# EAGLE design HARE - Master Schematic v1.0 (EAGLE 8.4.1)
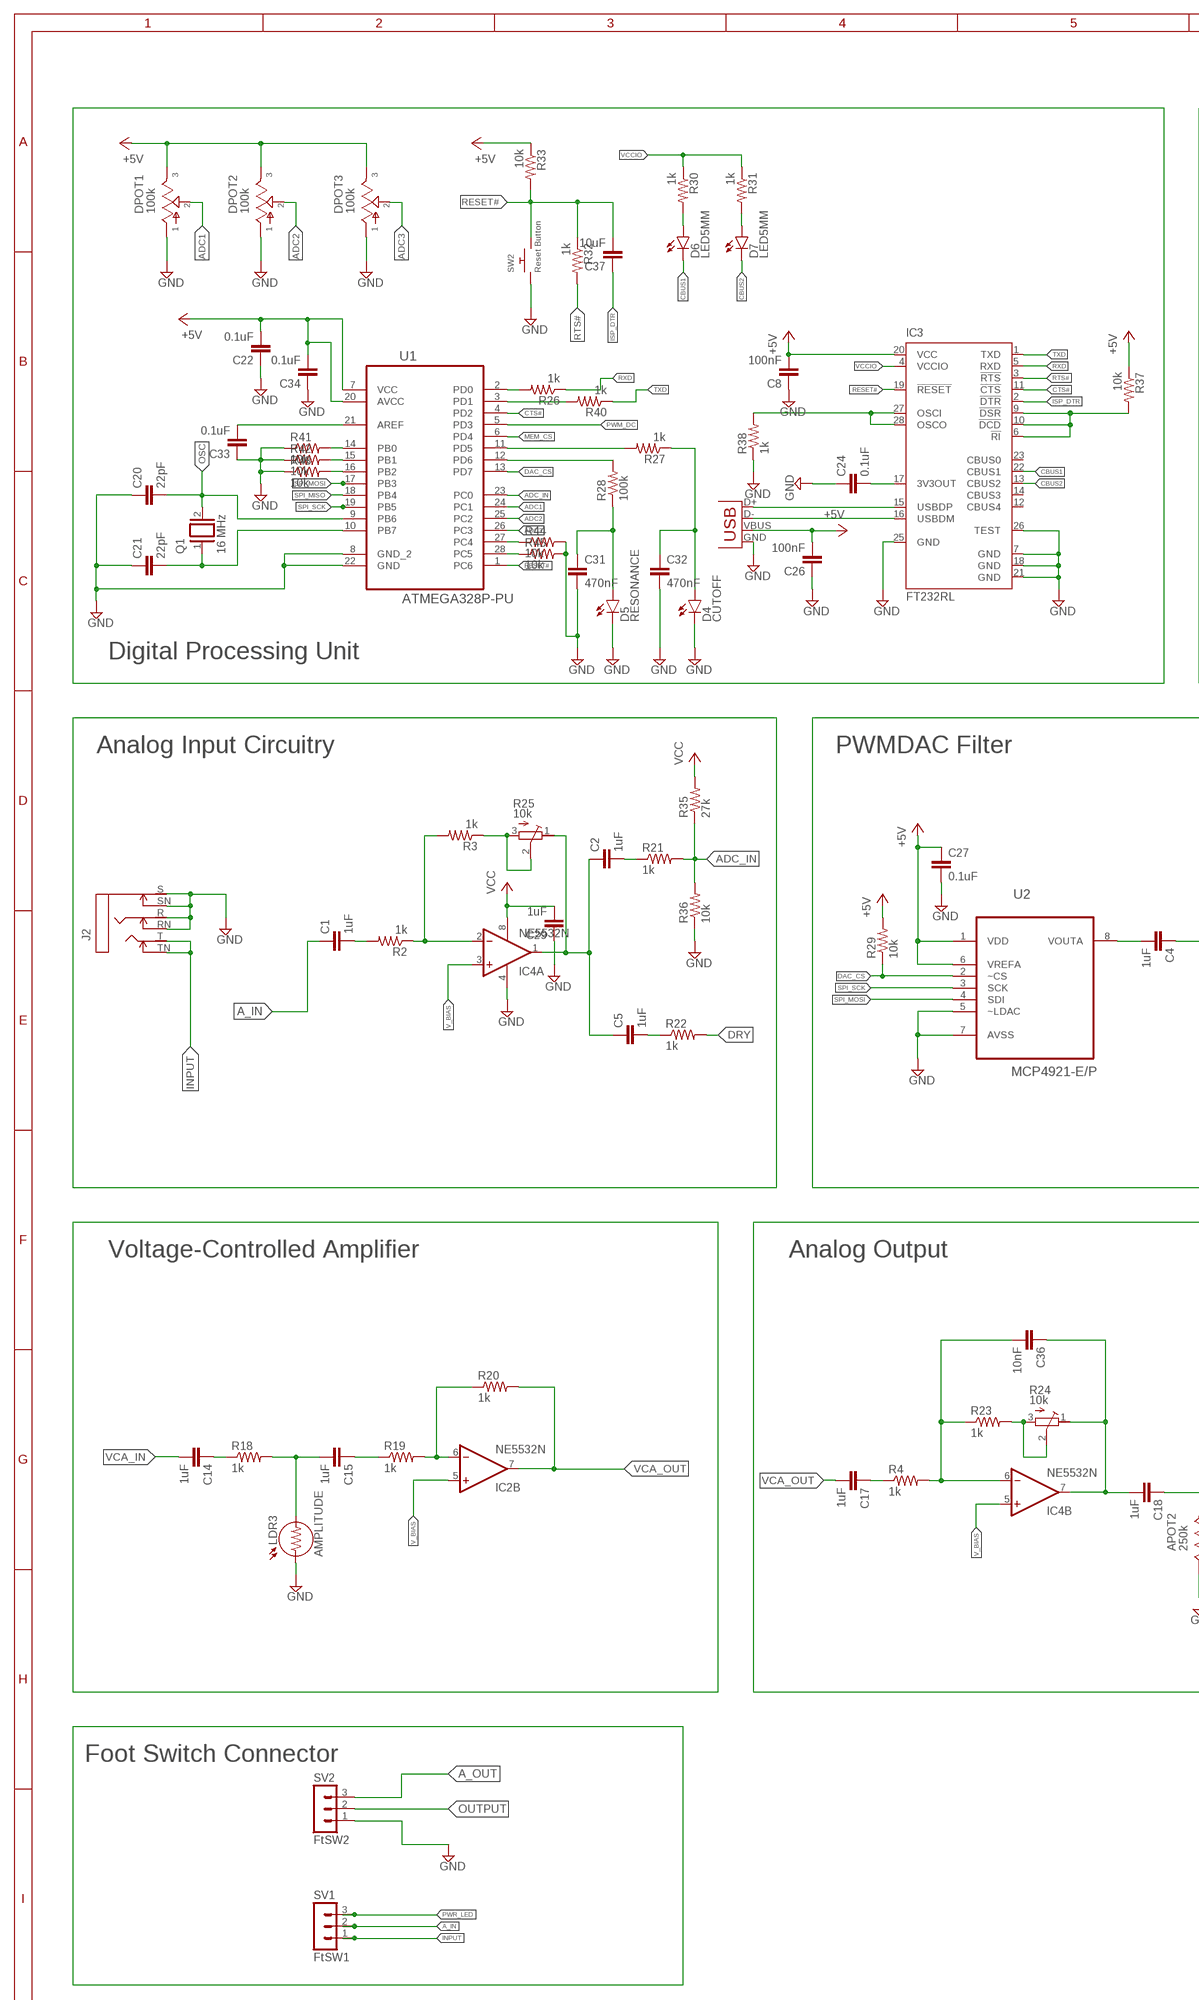
[diagram p0: schematic, sheet 1, part 1 of 2]
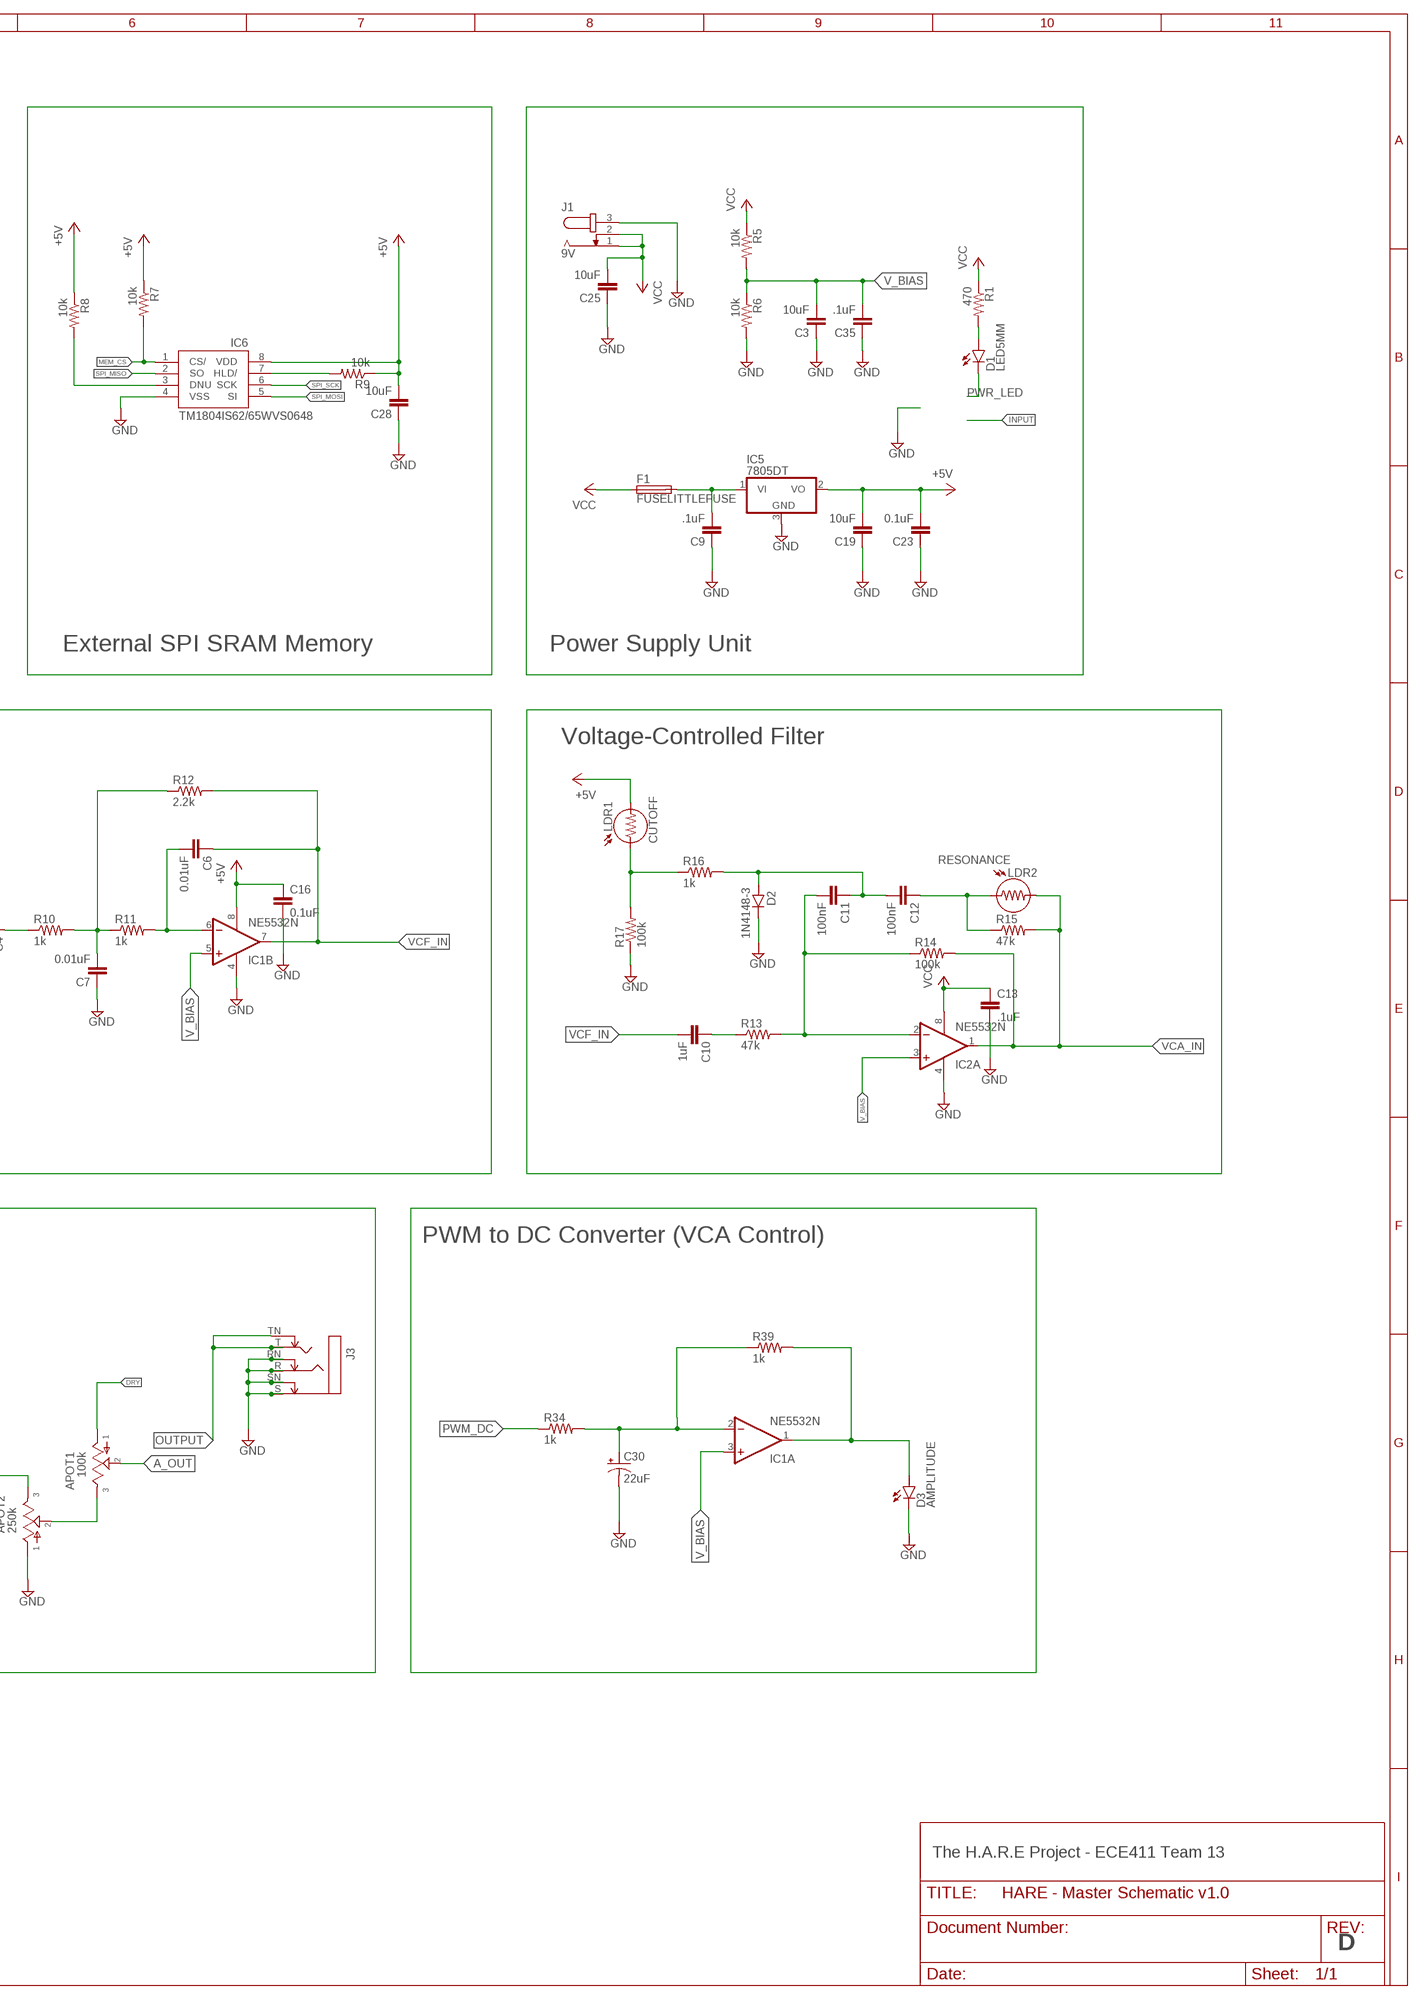
[diagram p1: schematic, sheet 1, part 2 of 2]

## Parts
APOT1  100k  POTS  [16MM-SQUARE]
APOT2  250k  POTS  [16MM-SQUARE]
C1  1uF  C-EUC0805K  [C0805K]
C2  1uF  C-EUC0805K  [C0805K]
C3  10uF  C-EUC0805K  [C0805K]
C4  1uF  C-EUC0805K  [C0805K]
C5  1uF  C-EUC0805K  [C0805K]
C6  0.01uF  C-EUC0805K  [C0805K]
C7  0.01uF  C-EUC0805K  [C0805K]
C8  100nF  C-EUC0805K  [C0805K]
C9  .1uF  C-EUC0805K  [C0805K]
C10  1uF  C-EUC0805K  [C0805K]
C11  100nF  C-EUC0805K  [C0805K]
C12  100nF  C-EUC0805K  [C0805K]
C13  .1uF  C-EUC0805K  [C0805K]
C14  1uF  C-EUC0805K  [C0805K]
C15  1uF  C-EUC0805K  [C0805K]
C16  0.1uF  C-EUC0805K  [C0805K]
C17  1uF  C-EUC0805K  [C0805K]
C18  1uF  C-EUC0805K  [C0805K]
C19  10uF  C-EUC0805K  [C0805K]
C20  22pF  C-EUC0805K  [C0805K]
C21  22pF  C-EUC0805K  [C0805K]
C22  0.1uF  C-EUC0805K  [C0805K]
C23  0.1uF  C-EUC0805K  [C0805K]
C24  0.1uF  C-EUC0805K  [C0805K]
C25  10uF  C-EUC0805K  [C0805K]
C26  100nF  C-EUC0805K  [C0805K]
C27  0.1uF  C-EUC0805K  [C0805K]
C28  10uF  C-EUC0805K  [C0805K]
C29  1uF  C-EUC0805K  [C0805K]
C30  22uF  0501  [050_020_1]
C31  470nF  072X0352  [072X035]
C32  470nF  072X0352  [072X035]
C33  0.1uF  C-EUC0805K  [C0805K]
C34  0.1uF  C-EUC0805K  [C0805K]
C35  .1uF  C-EUC0805K  [C0805K]
C36  10nF  C-EUC0805K  [C0805K]
C37  10uF  C-EUC0805K  [C0805K]
D1  LED5MM  [LED5MM]
D2  1N4148-3  [DO35-3]
D3  AMPLITUDE  LED5MM  [LED5MM]
D4  CUTOFF  LED5MM  [LED5MM]
D5  RESONANCE  LED5MM  [LED5MM]
D6  LED5MM  [LED5MM]
D7  LED5MM  [LED5MM]
DPOT1  100k  POTS  [16MM-SQUARE]
DPOT2  100k  POTS  [16MM-SQUARE]
DPOT3  100k  POTS  [16MM-SQUARE]
F1  FUSELITTLEFUSE  [LITTLEFUSE]
IC1  NE5532N  [DIL08]
IC2  NE5532N  [DIL08]
IC3  FT232RL  [SSOP28]
IC4  NE5532N  [DIL08]
IC5  7805DT  [TO252]
IC6  TM1804IS62/65WVS0648  [SO08]
J1  9V  JACK-PLUG1  [SPC4078]
J2  STEREOSW  [NMJ6HCD2]
J3  STEREOSW  [NMJ6HCD2]
LDR1  CUTOFF  LDR5MM  [LDR338-54C]
LDR2  RESONANCE  LDR5MM  [LDR338-54C]
LDR3  AMPLITUDE  LDR5MM  [LDR338-54C]
Q1  16 MHz  XTAL/S  [QS]
R1  470  R-US_M0805  [M0805]
R2  1k  R-US_R0805  [R0805]
R3  1k  R-US_R0805  [R0805]
R4  1k  R-US_R0805  [R0805]
R5  10k  R-US_M0805  [M0805]
R6  10k  R-US_M0805  [M0805]
R7  10k  R-US_M0805  [M0805]
R8  10k  R-US_M0805  [M0805]
R9  10k  R-US_M0805  [M0805]
R10  1k  R-US_R0805  [R0805]
R11  1k  R-US_R0805  [R0805]
R12  2.2k  R-US_R0805  [R0805]
R13  47k  R-US_R0805  [R0805]
R14  100k  R-US_R0805  [R0805]
R15  47k  R-US_R0805  [R0805]
R16  1k  R-US_R0805  [R0805]
R17  100k  R-US_R0805  [R0805]
R18  1k  R-US_R0805  [R0805]
R19  1k  R-US_R0805  [R0805]
R20  1k  R-US_R0805  [R0805]
R21  1k  R-US_R0805  [R0805]
R22  1k  R-US_R0805  [R0805]
R23  1k  R-US_R0805  [R0805]
R24  10k  R-TRIMM3314G  [RTRIM3314G]
R25  10k  R-TRIMM3314G  [RTRIM3314G]
R26  1k  R-US_R0805  [R0805]
R27  1k  R-US_R0805  [R0805]
R28  100k  R-US_R0805  [R0805]
R29  10k  R-US_R0805  [R0805]
R30  1k  R-US_R0805  [R0805]
R31  1k  R-US_R0805  [R0805]
R32  1k  R-US_R0805  [R0805]
R33  10k  R-US_R0805  [R0805]
R34  1k  R-US_R0805  [R0805]
R35  27k  R-US_R0805  [R0805]
R36  10k  R-US_R0805  [R0805]
R37  10k  R-US_R0805  [R0805]
R38  1k  R-US_R0805  [R0805]
R39  1k  R-US_R0805  [R0805]
R40  1k  R-US_R0805  [R0805]
R41  10k  R-US_R0805  [R0805]
R42  10k  R-US_R0805  [R0805]
R43  10k  R-US_R0805  [R0805]
R44  10k  R-US_R0805  [R0805]
R45  10k  R-US_R0805  [R0805]
SV1  FtSW1  MA03-1  [MA03-1]
SV2  FtSW2  MA03-1  [MA03-1]
SW2  Reset Button  SWITCH_PUSHBUTTONSOFTTOUCHSMD_SJ  [PUSHBUTTON_SMD_SJ]
U1  ATMEGA328P-PU  [DIP254P762X457-28]
U2  MCP4921-E/P  [DIP254P762X432-8]
X2  USB-B-H  [USB-B-H]

## Nets
+5V: C8.2 C16.1 C19.2 C22.2 C23.2 C26.2 C27.1 C28.2 C34.2 DPOT1.3 DPOT2.3 DPOT3.3 IC1.8(P:V+) IC3.20(VCC) IC5.2(VO) IC6.8(VDD) LDR1.2 R7.1 R8.1 R9.1 R29.2 R33.1 R37.1 U1.7(VCC) U1.20(AVCC) U2.1(VDD) U2.6(VREFA) X2.VBUS
+5V1: C33.2 U1.21(AREF)
A_IN: C1.1 SV1.2
A_OUT: APOT1.2 SV2.3
ADC1: DPOT1.2 U1.24(PC1)
ADC2: DPOT2.2 U1.25(PC2)
ADC3: DPOT3.2 U1.26(PC3)
ADC_IN: R21.2 R35.1 R36.2 U1.23(PC0)
CBUS1: D6.K(C) IC3.22(CBUS1)
CBUS2: D7.K(C) IC3.13(CBUS2)
CTS#: IC3.11(!CTS) U1.4(PD2)
DAC_CS: R29.1 U1.13(PD7) U2.2(~CS)
DRY: APOT1.1 R22.2
GND: APOT2.1 C3.1 C7.1 C8.1 C9.1 C13.2 C16.2 C19.1 C20.1 C21.1 C22.1 C23.1 C24.1 C25.1 C26.1 C27.2 C28.1 C29.1 C30.- C31.2 C32.2 C33.1 C34.1 C35.1 D2.C D3.K(C) D4.K(C) D5.K(C) DPOT1.1 DPOT2.1 DPOT3.1 IC1.4(P:V-) IC2.4(P:V-) IC3.7(GND) IC3.18(GND) IC3.21(GND) IC3.25(GND) IC3.26(TEST) IC4.4(P:V-) IC5.3(GND) IC6.4(VSS) J1.3 J2.R J2.RN J2.S J2.SN J3.R J3.RN J3.S J3.SN LDR3.1 R6.2 R17.1 R36.1 R38.1 R41.1 R42.1 R43.1 R44.2 R45.2 SV2.1 SW2.P$1 U1.8(GND_2) U1.22(GND) U2.5(~LDAC) U2.7(AVSS) X2.GND
INPUT: J2.T J2.TN SV1.1
ISP_DTR: C37.1 IC3.2(!DTR)
MEM_CS: IC6.1(CS/) R7.2 U1.6(PD4)
N$7: D1.A R1.2
N$8: IC6.7(HLD/) R9.2
N$10: C1.2 R2.2
N$11: IC4.2(A:-IN) R2.1 R3.2
N$12: C4.2 U2.8(VOUTA)
N$13: C4.1 R10.1
N$14: C5.2 R22.1
N$15: C30.+ IC1.2(A:-IN) R34.2 R39.1
N$16: C7.2 R10.2 R11.1 R12.1
N$17: C6.2 IC1.6(B:-IN) R11.2
N$18: IC6.3(DNU) R8.2
N$19: D3.A IC1.1(A:OUT) R39.2
N$21: C10.1 R13.1
N$22: C11.2 IC2.2(A:-IN) R13.2 R14.1
N$24: IC3.6(!RI) IC3.9(!DSR) IC3.10(!DCD) R37.2
N$25: C12.1 LDR2.1 R15.1
N$27: C11.1 C12.2 D2.A R16.2
N$28: IC3.27(OSCI) IC3.28(OSCO) R38.2
N$29: LDR1.1 R16.1 R17.2
N$30: C14.1 R18.1
N$31: C15.2 LDR3.2 R18.2
N$32: C15.1 R19.1
N$33: IC2.6(B:-IN) R19.2 R20.1
N$34: C9.2 F1.2 IC5.1(VI)
N$35: R26.2 U1.2(PD0)
N$36: C2.2 R21.1
N$37: C2.1 C5.1 IC4.1(A:OUT) R25.1(E)
N$38: R40.2 U1.3(PD1)
N$39: R41.2 U1.14(PB0)
N$40: C17.1 R4.1
N$41: C36.2 IC4.6(B:-IN) R4.2 R23.1
N$42: R23.2 R24.2(S) R24.3(A)
N$43: C18.2 C36.1 IC4.7(B:OUT) R24.1(E)
N$44: R42.2 U1.15(PB1)
N$45: APOT2.3 C18.1
N$46: APOT1.3 APOT2.2
N$47: R43.2 U1.16(PB2)
N$49: R3.1 R25.2(S) R25.3(A)
N$50: R44.1 U1.27(PC4)
N$51: C21.2 Q1.1 U1.10(PB7)
N$52: IC3.15(USBDP) X2.D+
N$53: IC3.16(USBDM) X2.D-
N$54: C24.2 IC3.17(3V3OUT)
N$55: R45.1 U1.28(PC5)
N$56: R28.2 U1.12(PD6)
N$57: C31.1 D5.A R28.1
N$58: R27.2 U1.11(PD5)
N$59: C32.1 D4.A R27.1
N$63: D6.A R30.2
N$64: D7.A R31.2
OSC: C20.2 Q1.2 U1.9(PB6)
OUTPUT: J3.T J3.TN SV2.2
PWM_DC: R34.1 U1.5(PD3)
PWR_LED: D1.K(C) SV1.3
RESET#: C37.2 IC3.19(!RESET) R32.1 R33.2 SW2.P$2 U1.1(PC6)
RTS#: IC3.3(!RTS) R32.2
RXD: IC3.5(RXD) R26.1
SPI_MISO: IC6.2(SO) U1.18(PB4)
SPI_MOSI: IC6.5(SI) U1.17(PB3) U2.4(SDI)
SPI_SCK: IC6.6(SCK) U1.19(PB5) U2.3(SCK)
TXD: IC3.1(TXD) R40.1
V_BIAS: C3.2 C35.2 IC1.3(A:+IN) IC1.5(B:+IN) IC2.3(A:+IN) IC2.5(B:+IN) IC4.3(A:+IN) IC4.5(B:+IN) R5.2 R6.1
VCA_IN: C14.2 IC2.1(A:OUT) LDR2.2 R14.2 R15.2
VCA_OUT: C17.2 IC2.7(B:OUT) R20.2
VCC: C13.1 C25.2 C29.2 F1.1 IC2.8(P:V+) IC4.8(P:V+) J1.1 J1.2 R1.1 R5.1 R35.2
VCCIO: IC3.4(VCCIO) R30.1 R31.1
VCF_IN: C6.1 C10.2 IC1.7(B:OUT) R12.2
Unconnected: IC3.12(CBUS4) IC3.14(CBUS3) IC3.23(CBUS0)

## Notes on the sheet
- Digital Processing Unit | External SPI SRAM Memory | Power Supply Unit
- Analog Input Circuitry | PWMDAC Filter | Voltage-Controlled Filter
- Voltage-Controlled Amplifier | Analog Output | PWM to DC Converter (VCA Control)
- Foot Switch Connector
- The H.A.R.E Project - ECE411 Team 13
- D

## Library data of the parts
APOT1 APOT2 DPOT1-DPOT3 = gm-pots:POT: Potentiometers the arrow indicates the clockwise motion of th wiper (lug 2) fully counter clockwise there is no resistance between lugs 1 and 2 fully clockwise the resistance between lugs 1 and 2 is the value of the pot
C1-C29 C33-C37 = resistor:C-EU: CAPACITOR, European symbol
C30 = gm-caps-electro-pol:050: 0.22 - 100uF Xicon values at Mouser.com: 10V: 10 - 100uF; 16V: 2.2 - 47uF; 25V: 0.47 - 47uF; 50V: 0.22 - 22uF
C31 C32 = gm-caps-film-box:072X035: 0.15 - 1.0uF; WIMA MKP2 63, 100V: 0.047uF; MKS2 50V: 0.68 - 1.0uF; 63V: 0.33 - 0.47uF; 100V: 0.15 - 0.22uF;
D1 D3-D7 = gm-diodes:LED
D2 = gm-diodes:1N4148: Fast Switching Diode DO-35 glass case a.k.a. 1N914
F1 = fuse:FUSE: Fuse; OC_FARNELL: unknown; OC_NEWARK: unknown
IC1 IC2 IC4 = gm-ics:NE5532: AUDIO AMPLIFIER
IC3 = ftdichip:FT232R: Source: http://www.ftdichip.com/Documents/DataSheets/DS_FT232R_v104.pdf; MPN: FT232RL; OC_FARNELL: 1146032; OC_NEWARK: 91K9918
IC5 = gm-regulators:78*: Positive VOLTAGE REGULATOR Source: http://cache.national.com/ds/LM/LM78L05.pdf http://www.fairchildsemi.com/ds/LM/LM7805.pdf
IC6 = IS62-65WVS0648:TM1804: IS6265WVS0684 is a serial communication SRAM IC
J1 = con-jack:JACK-PLUG: DC POWER JACK Power Jack, DC, Right Angle, Through Hole, Rated 5A at 16VDC, PC Terminals Distributor: Farnell (www.Farnell.de) Drawing: 84N1161.pdf / 84N1162.pdf Manufacturer: SPC Technology (www.spctechnology.com) Type: SPC4077 / SPC 4078; OC_FARNELL: unknown; OC_NEWARK: unknown
J2 J3 = gm-jacks:STEREOSW
LDR1-LDR3 = gm-resistors:LDR
Q1 = special:XTAL/S: CRYSTAL
R1 R5-R9 = rcl:R-US_: RESISTOR, American symbol
R2-R4 R10-R23 R26-R45 = resistor:R-US_: RESISTOR, American symbol
R24 R25 = resistor:R-TRIMM: Trimm resistor
SV1 SV2 = con-lstb:MA03-1: PIN HEADER; OC_FARNELL: unknown; OC_NEWARK: unknown
SW2 = adafruit:SWITCH_PUSHBUTTON: Buttons SOFTTOUCHSMD_SJ - Soft touch temporary push button (Super Junk Akihabara) Compatible with SKPMANE010 [Mouser: 688-SKPMAN] C&K_KSS = Digikey: KSS221GLFS
U1 = Atmel_By_element14_Batch_1-00:ATMEGA328P-PU: 8-bit Microcontroller with In-System Programmable Flash; MPN: ATMEGA328P-PU; OC_FARNELL: 1715487; OC_NEWARK: 15R0268; PACKAGE: PDIP-28; SUPPLIER: Atmel
U2 = MCP4921-E_P:MCP4921-E/P: DAC; AVAILABILITY: Good; DESCRIPTION: MCP4921 Series 1 Ch 12-Bit Voltage Output Digital-to-Analog Converter-PDIP-8; MF: Microchip; MP: MCP4921-E/P; PACKAGE: DIP-8 Microchip; PRICE: 1.82 USD
X2 = con-usb:USB: USB Connectors

## Board
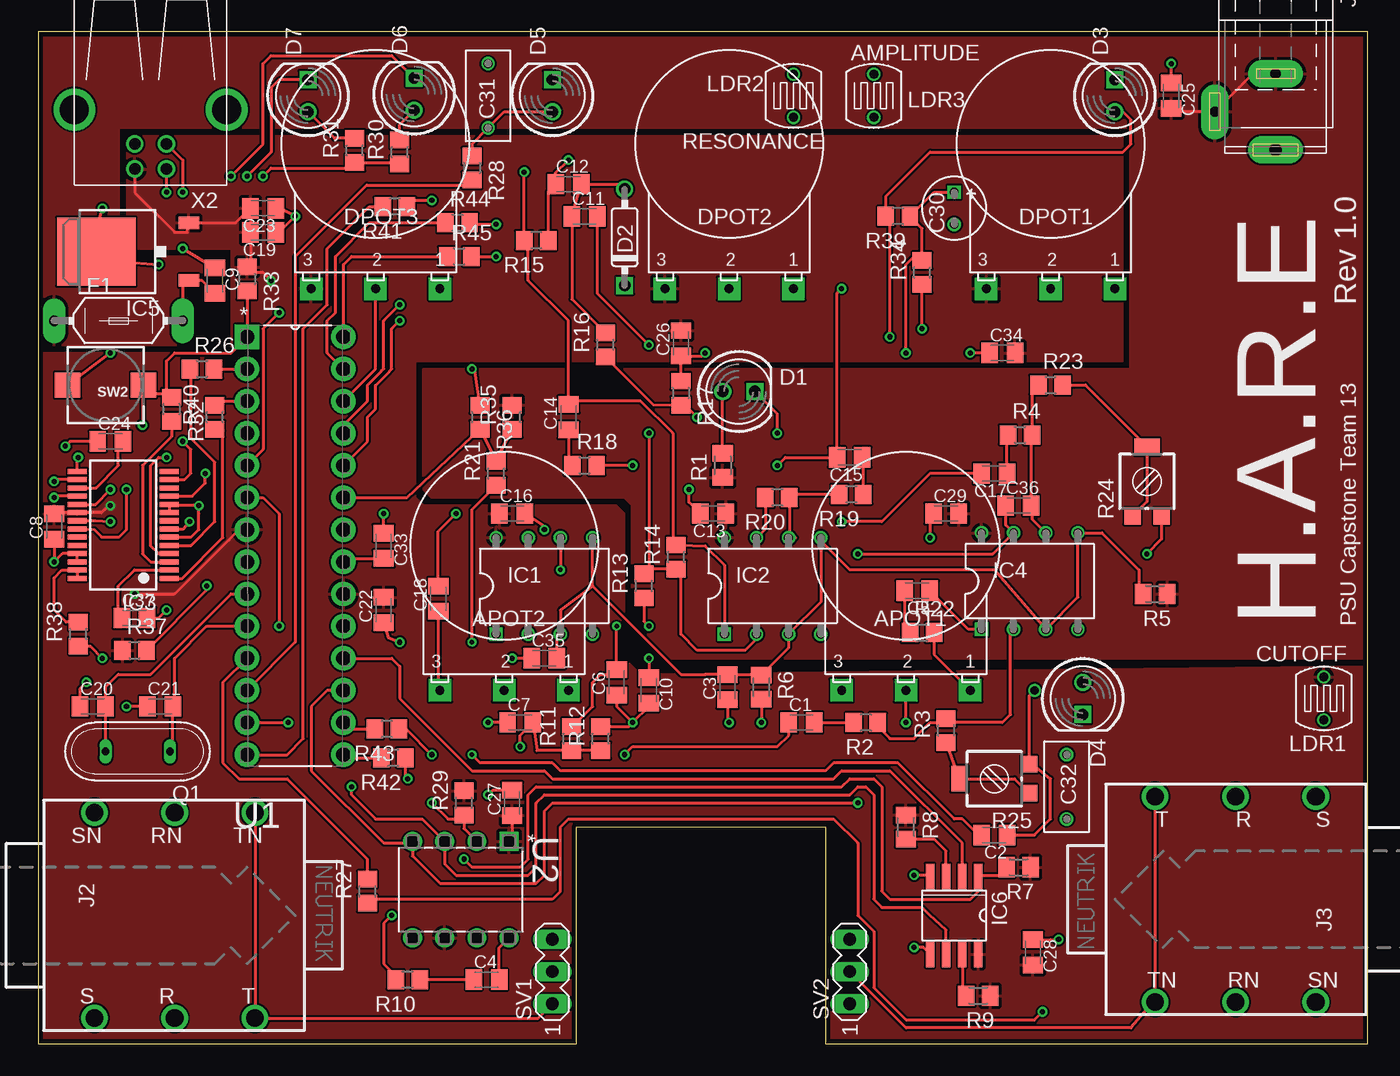
[diagram p2: board, top side]
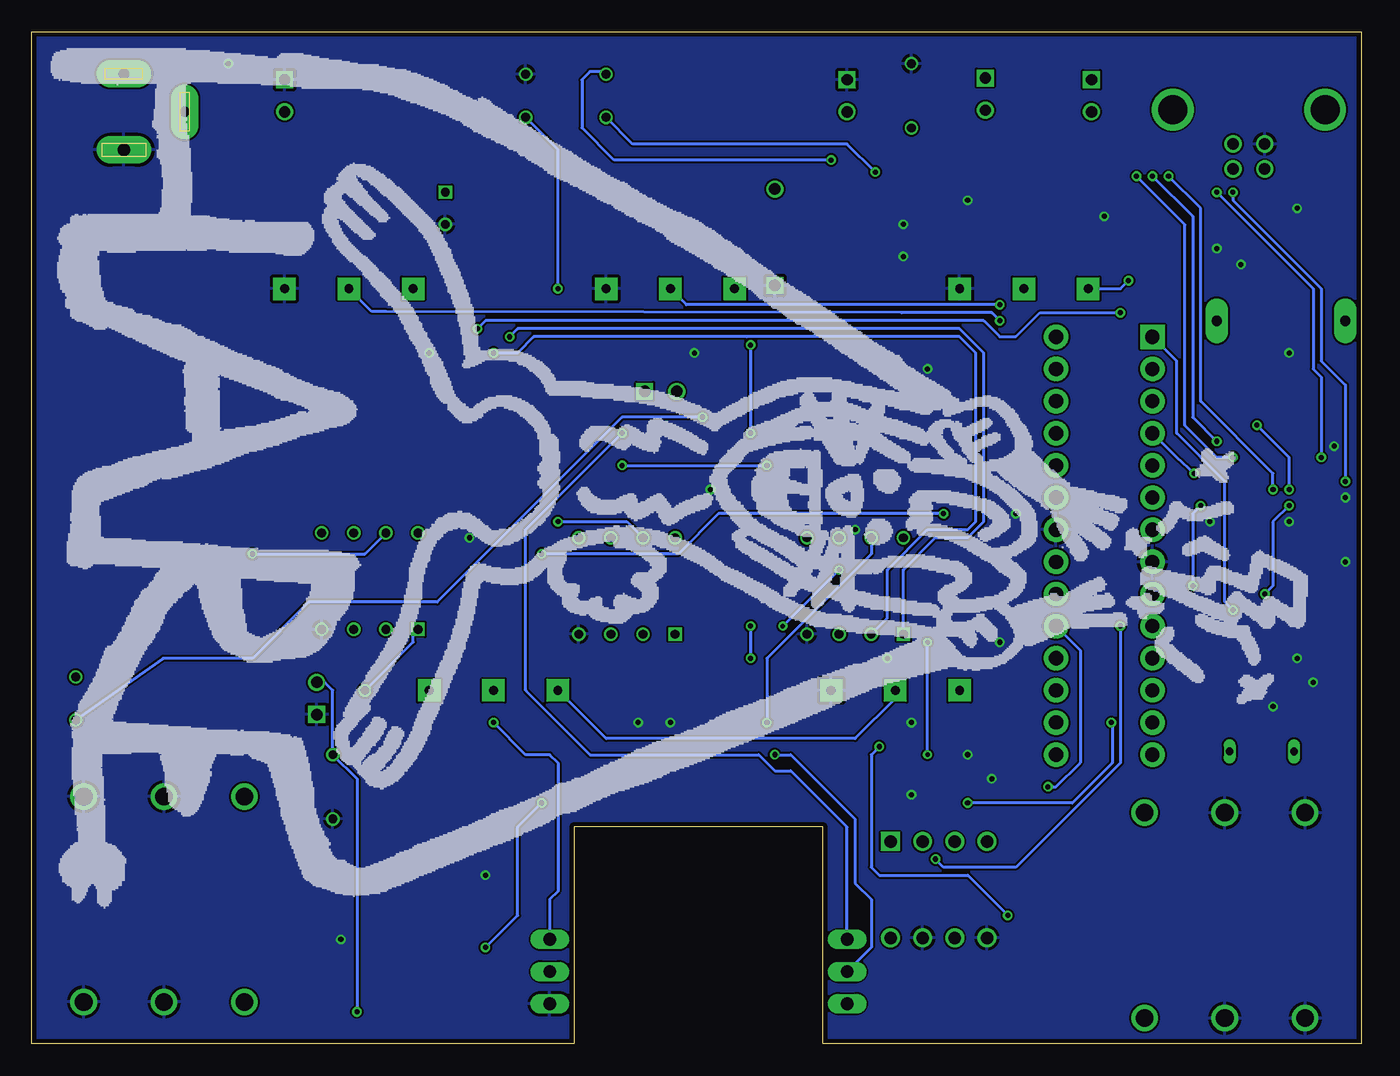
[diagram p3: board, bottom side, seen from below]

Size 105.08 x 80 mm. Coordinates in mm from the lower left corner, seen from the top.
Outline: 0,0 42.55,0 42.55,17.14 62.23,17.14 62.23,0 105.08,0 105.08,80 0,80 0,0
Copper layers (1*16): Top 0.0356mm / dielectric 1.5011mm / Bottom 0.0356mm
Design rules "oshpark-2layer": minimum track width 6mil, minimum drill 13mil, track to track 6mil, track to pad 6mil, pad to pad 6mil, via to via 6mil, smd to smd 6mil, copper to edge 15mil, drill to drill 6mil, minimum pad ring 7mil, minimum via ring 7mil, stop-mask expansion 2.5mil, vias tented up to drill 0mil, thermal gap 10mil

### Footprints (pad centres in the part's own frame; a part is rotated, then mirrored left to right if it is on the bottom)
16MM-SQUARE = drill 0.7 pad 1.778 square: 1 5.08,0; 2 0,0; 3 -5.08,0
C0805K = smd 1.3 x 1.6: 1 -1,0; 2 1,0
050_020_1 = drill 0.7 square: + -1.27,0 | drill 0.7: - 1.27,0
072X035 = drill 0.7: 1 -2.54,0; 2 2.54,0
LED5MM = drill 0.9: A -1.27,0 | drill 0.9 square: K 1.27,0
DO35-3 = drill 0.9: A 3.81,0 | drill 0.9 square: C -3.81,0
LITTLEFUSE = drill 0.813 pad 1.778 long: 1 -5.08,0; 2 5.08,0
DIL08 = drill 0.7 square: 1 -3.81,-3.81 | drill 0.7: 2 -1.27,-3.81; 3 1.27,-3.81; 4 3.81,-3.81; 5 3.81,3.81; 6 1.27,3.81; 7 -1.27,3.81; 8 -3.81,3.81
SSOP28 = smd 0.4 x 1.5: 1 -4.225,-3.625; 2 -3.575,-3.625; 3 -2.925,-3.625; 4 -2.275,-3.625; 5 -1.625,-3.625; 6 -0.975,-3.625; 7 -0.325,-3.625; 8 0.325,-3.625; 9 0.975,-3.625; 10 1.625,-3.625; 11 2.275,-3.625; 12 2.925,-3.625; 13 3.575,-3.625; 14 4.225,-3.625; 15 4.225,3.625; 16 3.575,3.625; 17 2.925,3.625; 18 2.275,3.625; 19 1.625,3.625; 20 0.975,3.625; 21 0.325,3.625; 22 -0.325,3.625; 23 -0.975,3.625; 24 -1.625,3.625; 25 -2.275,3.625; 26 -2.925,3.625; 27 -3.575,3.625; 28 -4.225,3.625
TO252 = smd 1 x 1.6: 1 -2.28,-4.8; 2 2.28,-4.8 | smd 5.4 x 6.2: 3 0,2.5
SO08 = smd 0.66 x 2.032: 1 -1.905,-3.073; 2 -0.635,-3.073; 3 0.635,-3.073; 4 1.905,-3.073; 5 1.905,3.073; 6 0.635,3.073; 7 -0.635,3.073; 8 -1.905,3.073
SPC4078 = drill 0.8 pad 2.184 long: 1 -3,0; 2 0,-4.8 | drill 1 pad 2.184 long: 3 3,0
NMJ6HCD2 = drill 1.397: R 0,8.115; RN 0,-8.115; S 6.35,8.115; SN 6.35,-8.115; T -6.35,8.115; TN -6.35,-8.115
LDR338-54C = drill 0.7: 1 0,1.702; 2 0,-1.702
QS = drill 0.61 long: 1 -2.54,0; 2 2.54,0
M0805 = smd 1.3 x 1.6: 1 -0.95,0; 2 0.95,0
R0805 = smd 1.3 x 1.5: 1 -0.95,0; 2 0.95,0
RTRIM3314G = smd 1.3 x 1.3: 1 1.15,-2.75; 3 -1.15,-2.75 | smd 2 x 1.3: 2 0,2.75
MA03-1 = drill 1.016 long: 1 -2.54,0; 2 0,0; 3 2.54,0
PUSHBUTTON_SMD_SJ = smd 2 x 2: P$1 3,0; P$2 -3,0
DIP254P762X457-28 = drill 1.118 pad 1.93 square: 1 -7.62,33.02 | drill 1.118 pad 1.93: 2 -7.62,30.48; 3 -7.62,27.94; 4 -7.62,25.4; 5 -7.62,22.86; 6 -7.62,20.32; 7 -7.62,17.78; 8 -7.62,15.24; 9 -7.62,12.7; 10 -7.62,10.16; 11 -7.62,7.62; 12 -7.62,5.08; 13 -7.62,2.54; 14 -7.62,0; 15 0,0; 16 0,2.54; 17 0,5.08; 18 0,7.62; 19 0,10.16; 20 0,12.7; 21 0,15.24; 22 0,17.78; 23 0,20.32; 24 0,22.86; 25 0,25.4; 26 0,27.94; 27 0,30.48; 28 0,33.02
DIP254P762X432-8 = drill 0.991 square: 1 -7.62,7.62 | drill 0.991: 2 -7.62,5.08; 3 -7.62,2.54; 4 -7.62,0; 5 0,0; 6 0,2.54; 7 0,5.08; 8 0,7.62
USB-B-H = drill 0.914: D+ 0,1.25; D- 1.981,1.25; GND 0,-1.25; VBUS 1.981,-1.25 | drill 2.286: P$1 -2.718,-6.02; P$2 -2.718,6.02

### Placement (x,y rotation side)
APOT1  68.58,27.94 0 top
APOT2  36.83,27.94 0 top
C1  60.33,25.4 0 top
C2  75.56,16.51 180 top
C3  54.48,28.19 90 top
C4  35.43,5.08 0 top
C5  69.47,35.81 180 top
C6  45.72,28.57 90 top
C7  38.1,25.4 0 top
C8  1.27,40.89 90 top
C9  13.97,60.33 270 top
C10  48.26,27.94 270 top
C11  43.18,65.41 0 top
C12  41.91,67.94 0 top
C13  53.34,41.91 180 top
C14  41.91,49.53 90 top
C15  64.14,46.35 180 top
C16  37.47,41.91 0 top
C17  75.56,45.09 180 top
C18  31.62,35.18 90 top
C19  17.78,64.14 180 top
C20  4.32,26.67 0 top
C21  9.65,26.67 0 top
C22  27.3,34.29 90 top
C23  17.78,66.04 180 top
C24  5.71,47.62 0 top
C25  89.53,74.93 270 top
C26  50.8,55.37 90 top
C27  37.47,19.05 90 top
C28  78.61,7.24 270 top
C29  71.75,41.91 0 top
C30  72.39,66.04 270 top
C31  35.56,74.93 90 top
C32  81.28,20.32 270 top
C33  27.3,39.37 270 top
C34  76.2,54.61 0 top
C35  40.01,30.48 0 top
C36  77.47,42.55 0 top
C37  7.62,33.66 0 top
D1  55.37,51.56 0 top
D2  46.35,63.75 90 top
D3  85.09,74.93 90 top
D4  82.55,27.3 270 top
D5  40.64,74.93 90 top
D6  29.72,75.06 90 top
D7  21.34,74.93 90 top
DPOT1  80.01,59.69 0 top
DPOT2  54.61,59.69 0 top
DPOT3  26.67,59.69 0 top
F1  6.35,57.15 0 top
IC1  40.01,36.2 0 top
IC2  58.04,36.2 0 top
IC3  6.73,41.02 90 top
IC4  78.36,36.58 0 top
IC5  7.11,62.61 90 top
IC6  72.39,10.16 180 top
J1  97.79,73.66 270 top
J2  10.79,10.16 180 top
J3  94.61,11.43 0 top
LDR1  101.6,27.3 180 top
LDR2  59.69,74.93 0 top
LDR3  66.04,74.93 0 top
Q1  7.87,23.11 180 top
R1  54.1,45.72 90 top
R2  65.41,25.4 180 top
R3  71.75,24.77 90 top
R4  77.6,48.13 0 top
R5  88.27,35.56 180 top
R6  57.15,28.19 270 top
R7  77.47,13.97 180 top
R8  68.58,17.14 270 top
R9  74.3,3.81 180 top
R10  29.21,5.08 180 top
R11  42.16,24.13 90 top
R12  44.45,24.13 90 top
R13  47.88,36.2 90 top
R14  50.42,38.48 90 top
R15  39.37,63.5 180 top
R16  44.83,55.24 90 top
R17  50.8,51.44 270 top
R18  43.18,45.72 0 top
R19  64.26,43.43 180 top
R20  58.42,43.18 180 top
R21  36.2,45.09 90 top
R22  69.85,32.51 0 top
R23  80.01,52.07 0 top
R24  87.63,44.45 0 top
R25  75.56,20.95 90 top
R26  12.95,53.34 0 top
R27  26.04,12.06 90 top
R28  34.29,69.22 270 top
R29  33.66,19.05 90 top
R30  28.57,70.48 90 top
R31  25.02,70.61 90 top
R32  10.54,50.16 270 top
R33  16.51,60.45 270 top
R34  69.85,60.96 90 top
R35  37.47,49.53 90 top
R36  34.92,49.53 270 top
R37  7.62,31.11 0 top
R38  3.17,32.38 90 top
R39  67.94,65.41 180 top
R40  13.97,49.53 90 top
R41  28.19,66.17 180 top
R42  28.07,22.61 180 top
R43  27.56,24.89 180 top
R44  33.15,64.9 0 top
R45  33.27,62.23 0 top
SV1  40.64,5.71 90 top
SV2  64.14,5.71 90 top
SW2  5.33,52.07 180 top
U1  24.13,22.86 0 top
U2  29.59,8.38 270 top
X2  8.89,71.12 270 top

### Tracks (layer width: path | path; a pad name or v marks a point on that pad's centre or on a via)
+5V  (via drill 0.4)
  Top 0.254: v5.71,42.55 4.99,42 IC3.20 1.37,42 C8.2 | U1.7 15.88,40.64 15.06,39.83 15.06,39.82 11.59,36.34 11.57,36.34 10.79,35.56 v7.62,35.56 | X2.VBUS 7.64,67.29 10.79,64.14 11.79,64.14 IC5.2 15.63,64.89 C23.2 C19.2 16.78,61.67 R33.1 16.95,60.96 17.78,60.96 v18.41,60.33 | C27.1 37.47,16.26 U2.1
  Bottom 0.254: v5.71,42.55 6.99,41.27 6.99,36.2 v7.62,35.56 | DPOT3.3 19.05,59.69 v18.41,60.33
  pour Top: 105.41,0 105.41,29.84 47.62,29.21 46.35,30.48 46.35,41.91 45.72,42.55 30.48,42.55 29.84,43.18 29.84,53.98 85.72,53.98 85.72,71.75 6.99,71.75 6.99,62.87 15.24,62.87 15.24,54.61 0,54.61 0,0 42.55,0 42.55,17.14 62.23,17.14 62.23,0
+5V1
  Top 0.254: U1.21 24.4,38.37 C33.2
A_IN  (via drill 0.4)
  Top 0.254: v46.35,22.86 46.99,23.5 58.42,23.5 59.33,24.4 C1.1
  Bottom 0.254: v46.35,22.86 45.09,22.86 40.01,17.78 40.01,16.51 40.01,12.7 38.73,11.43 38.73,7.62 SV1.2
A_OUT  (via drill 0.4)
  Top 0.254: v68.58,25.4 APOT1.2
  Bottom 0.254: SV2.3 64.14,11.43 63.5,12.06 63.5,22.23 64.14,22.86 66.04,22.86 v68.58,25.4
ADC1  (via drill 0.4)
  Top 0.254: U1.24 26.04,47.62 26.04,49.53 26.67,50.16 26.67,52.05 27.76,53.14 27.76,53.16 27.94,53.34 27.94,56.52 v28.57,57.15
  Bottom 0.254: v28.57,57.15 29.21,57.78 36.35,57.78 77.08,57.88 78.2,57.88 DPOT1.2
ADC2  (via drill 0.4)
  Top 0.254: U1.25 24.13,48.9 26.04,50.8 26.04,52.06 27.13,53.15 27.13,53.16 27.3,53.34 27.3,57.15 v28.57,58.42
  Bottom 0.254: v28.57,58.42 53.34,58.42 DPOT2.2
ADC3
  Top 0.254: U1.26 26.67,53.34 DPOT3.2
ADC_IN
  Top 0.254: U1.23 29.14,43.18 R36.2 R21.2 R35.1
CBUS1  (via drill 0.4)
  Top 0.254: IC3.22 4.45,40.64 5.02,40.06 6.41,40.06 6.99,40.64 v6.99,43.81 | v15.24,68.58 17.78,71.12 17.78,77.47 18.41,78.11 27.94,78.11 D6.K
  Bottom 0.254: v6.99,43.81 6.99,45.09 12.7,50.8 12.7,66.04 v15.24,68.58
CBUS2  (via drill 0.4)
  Top 0.254: D7.K 19.05,76.2 18.41,75.56 18.41,70.48 v16.51,68.58 | IC3.13 11.58,44.6 12.06,45.09 12.06,46.99 v11.43,47.62
  Bottom 0.254: v16.51,68.58 13.34,65.41 13.34,49.53 v11.43,47.62
CTS#  (via drill 0.4)
  Top 0.254: v13.21,45.09 13.21,44.32 12.18,43.3 IC3.11
  Bottom 0.254: v13.21,45.09 14.61,46.35 U1.4
DAC_CS  (via drill 0.4)
  Top 0.254: 17.14,25.4 U1.13 v19.76,25.4 | U2.2 33.66,17.02 R29.1 33.34,17.78 32.38,17.78 v31.11,19.05
  Bottom 0.254: v19.76,25.4 19.68,25.4 19.68,22.23 22.86,19.05 v31.11,19.05
DRY
  Top 0.254: R22.2 70.8,30.8 APOT1.1
GND  (via drill 0.4)
  Top 0.254: IC3.7 11.49,40.7 v11.98,41.27 | SW2.P$1 v5.71,54.61 | R17.1 C26.1 52.47,54.37 v52.7,54.61 | R36.1 34.54,53.09 v34.29,53.34 | R38.1 4.12,31.43 v5.08,30.48 5.39,30.48 | C20.1 3.32,28.08 v3.81,28.57 | C21.1 v6.99,26.67 | IC3.26 IC3.25 1.92,38.75 v1.27,38.1 C8.1 | IC3.18 1.39,43.3 v1.27,43.18 | IC3.21 4.52,41.35 v5.71,41.27 | v5.08,66.04 4.06,61.98 IC5.3 4.7,61.98 v9.53,61.59 | C25.1 v89.53,77.47 | C23.1 19.05,66.04 v20.32,65.41 19.05,64.14 C19.1 | C28.1 79.99,8.24 v80.64,8.26 | C22.1 27.67,32.12 v28.57,31.75 | C3.1 54.48,25.53 v54.61,25.4 | R6.2 v57.15,25.4 | C27.2 35.92,20.05 v35.56,19.68 | C16.2 40.01,40.91 v40.01,40.64 | C13.2 51.44,42.81 v51.44,43.81 | C29.1 70.48,41.64 v70.48,40.01 | C9.1 v11.43,62.87 | C7.1 v35.56,25.4 | C24.1 2.54,47.62 v2.16,47.24 | C33.1 v27.3,41.91 | C34.1 v73.66,54.61 | C35.1 v37.47,30.48 | IC6.4 70.38,13.34 v69.22,13.34 | R41.1 29.65,66.67 v31.11,66.67 | R44.2 34.22,64.77 v36.2,64.77 | R45.2 v36.2,62.23 | R42.1 29.02,21.15 v29.21,20.95 | R43.1 29.08,24.89 v31.11,22.86
  pour Bottom: 0,80.01 105.41,80.01 105.41,0 62.23,0 62.23,17.14 42.55,17.14 42.55,0 0,0
INPUT
  Top 0.254: J2.TN J2.T | J2.T 17.29,2.04 | J2.T 39.51,2.04 SV1.1
ISP_DTR
  Top 0.254: C37.1 6.35,33.92 6.35,36.2 7.62,37.47 7.64,37.45 IC3.2
MEM_CS  (via drill 0.4)
  Top 0.254: U1.6 17.78,43.18 19.05,41.91 v19.05,33.02 | v33.66,14.61 34.29,13.97 38.1,13.97 38.73,14.61 38.73,19.68 39.37,20.32 63.5,20.32 64.14,20.95 66.04,20.95 66.67,20.32 66.67,12.06 67.31,11.43 73.66,11.43 74.3,12.06 IC6.1 74.4,13.34 76.2,13.34 76.52,13.65 R7.2
  Bottom 0.254: v19.05,33.02 19.05,22.23 27.3,13.97 33.02,13.97 v33.66,14.61
N$7
  Top 0.254: R1.2 D1.A
N$8
  Top 0.254: IC6.7 73.03,4.45 73.34,4.12 R9.2
N$10
  Top 0.254: C1.2 R2.2
N$11
  Top 0.254: IC4.2 76.83,32.51 76.83,26.04 76.2,25.4 71.97,25.4 71.71,25.67 | R2.1 66.36,25.09 67.31,24.13 69.22,24.13 70.48,25.4 71.44,25.4 71.71,25.67 | 71.71,25.67 R3.2
N$12
  Top 0.254: C4.2 36.43,7.6 U2.8
N$13
  Top 0.254: C4.1 R10.1
N$14
  Top 0.254: C5.2 68.47,32.94 R22.1
N$15  (via drill 0.4)
  Top 0.254: v68.58,54.61 68.58,61.59 69.22,62.23 69.53,62.23 R34.2 69.85,64.45 R39.1 70.8,67.31 C30.+
  Bottom 0.254: IC1.2 37.47,33.66 37.47,37.47 34.29,40.64 31.11,40.64 30.48,41.27 30.48,54.61 31.77,55.9 48.53,55.9 48.55,55.88 65.41,55.88 66.67,54.61 v68.58,54.61
N$16  (via drill 0.4)
  Top 0.254: R12.1 R11.1 39.42,23.18 C7.2 38.1,24.4 v38.1,23.5 | v27.94,10.16 27.3,9.53 27.3,6.35 28.26,5.39 R10.2
  Bottom 0.254: v38.1,23.5 38.73,22.86 38.73,13.97 38.1,13.34 31.11,13.34 v27.94,10.16
N$17  (via drill 0.35)
  Top 0.254: IC1.6 v41.27,37.47 | v45.72,33.02 C6.2 45.35,29.21 44.45,29.21 43.81,28.57 43.81,26.67 42.23,25.08 R11.2
  Bottom 0.254: v41.27,37.47 v45.72,33.02
N$18
  Top 0.254: R8.2 70.8,16.2 71.75,15.24 IC6.3
N$19  (via drill 0.4)
  Top 0.254: v67.31,55.88 67.31,65.09 R39.2 67,67 70.48,70.48 85.72,70.48 86.36,71.12 86.36,73.03 85.72,73.66 D3.A
  Bottom 0.254: IC1.1 36.2,37.47 33.66,40.01 31.11,40.01 29.84,41.27 29.84,54.61 31.75,56.52 66.67,56.52 v67.31,55.88
N$21  (via drill 0.4)
  Top 0.254: R13.1 47.88,33.4 v48.26,33.02 | v48.26,30.48 C10.1
  Bottom 0.254: v48.26,33.02 v48.26,30.48
N$22  (via drill 0.4)
  Top 0.254: IC2.2 56.77,32 55.88,31.11 52.07,31.11 50.8,32.38 50.8,37.15 R14.1 48.27,37.53 48.26,37.53 | C11.2 44.18,59.33 v48.26,55.24 | v48.26,48.26 48.26,37.53 | 48.26,37.53 R13.2
  Bottom 0.254: v48.26,55.24 v48.26,48.26
N$24  (via drill 0.4)
  Top 0.254: IC3.9 IC3.10 10.46,42.55 v12.7,42.55 12.7,41.91 12.69,41.9 12.69,40.65 12.09,40.05 IC3.6 | R37.2 13.34,35.88 v13.34,36.2
  Bottom 0.254: v12.7,42.55 13.34,41.91 v13.34,36.2
N$25  (via drill 0.4)
  Top 0.254: R15.1 40.32,67.36 C12.1 40.91,68.85 v41.91,69.85
  Bottom 0.254: v41.91,69.85 59.05,69.85 61.59,72.39 61.59,76.2 60.96,76.83 59.89,76.83 LDR2.1
N$27
  Top 0.254: R16.2 42.18,58.85 C11.1 C12.2 45.97,67.94 D2.A
N$28
  Top 0.254: R38.2 2.23,33.34 1.27,34.29 1.27,36.83 1.89,37.45 IC3.27 IC3.28
N$29  (via drill 0.4)
  Top 0.254: R16.1 48.58,50.55 R17.2 51.12,50.48 v52.07,49.53
  Bottom 0.254: v52.07,49.53 58.42,49.53 73.03,34.92 83.19,34.92 87.63,30.48 94.69,30.48 LDR1.1
N$30
  Top 0.254: C14.1 41.91,46.04 R18.1
N$31  (via drill 0.4)
  Top 0.254: v58.42,45.72 59.05,46.35 C15.2 63.13,59.33 v63.5,59.69 | v46.99,45.72 R18.2
  Bottom 0.254: v58.42,45.72 v46.99,45.72 | v63.5,59.69 63.5,70.69 LDR3.2
N$32
  Top 0.254: R19.1 65.21,46.28 C15.1
N$33
  Top 0.254: 59.88,40.01 IC2.6 59.37,40.07 R20.1 59.62,43.43 R19.2
N$34
  Top 0.254: F1.2 11.43,59.85 arc-90 IC5.1 12.96,60.33 C9.2
N$35
  Top 0.254: R26.2 U1.2
N$36  (via drill 0.35)
  Top 0.254: C2.2 74.3,16.51 73.03,17.78 72.39,17.78 67.94,22.23 62.87,22.23 62.23,21.59 41.27,21.59 40.64,22.23 34.92,22.23 v34.29,22.86 | R21.1 34.29,42.23 v34.29,31.75
  Bottom 0.254: v34.29,22.86 v34.29,31.75
N$37  (via drill 0.65)
  Top 0.254: R25.1 78.31,27.52 v78.74,27.94 | IC4.1 73.52,32.77 C5.1 | R25.1 78.22,22.11 | C2.1 78.74,16.51 80.01,17.78 80.01,20.95 78.44,22.23 R25.1
  Bottom 0.254: IC4.1 74.93,32.38 74.93,31.75 v78.74,27.94
N$38
  Top 0.254: R40.2 14.29,50.8 U1.3
N$39
  Top 0.254: U1.14 19.68,22.86 20.95,24.13 20.95,56.52 22.86,58.42 22.86,62.87 26.16,66.17 R41.2
N$40
  Top 0.254: C17.1 76.56,47.42 R4.1
N$41
  Top 0.254: IC4.6 78.55,41.47 78.55,42.47 C36.2 78.47,48.06 R4.2 78.55,51.56 R23.1
N$42
  Top 0.254: R23.2 82.76,52.07 R24.2 87.63,42.85 R24.3
N$43  (via drill 0.4)
  Top 0.254: R24.1 88.78,39.88 v87.63,38.73 | C18.2 31.62,40.51 v33.02,41.91 | v64.77,38.73 75.44,38.73 IC4.7 76.47,41.01 C36.1
  Bottom 0.254: v87.63,38.73 78.74,38.73 IC4.7 | v33.02,41.91 50.8,41.91 53.98,38.73 v64.77,38.73
N$44
  Top 0.254: U1.15 24.38,22.61 R42.2
N$45
  Top 0.254: C18.1 31.62,28.07 APOT2.3
N$46
  Bottom 0.254: APOT2.2 36.83,27.3 40.01,24.13 59.69,24.13 APOT1.3
N$47
  Top 0.254: U1.16 24.64,24.89 R43.2
N$49
  Top 0.254: R25.2 77.17,20.95 R25.3 | R25.2 73.03,20.95 | R25.2 73.34,21.48 | R3.1 72.71,21.06 R25.2
N$50
  Top 0.254: U1.27 22.86,54.61 22.86,57.15 23.5,57.78 23.5,62.23 26.16,64.9 R44.1
N$51
  Top 0.254: Q1.1 10.65,23.35 C21.2 10.79,26.81 10.79,30.48 13.34,33.02 U1.10
N$52  (via drill 0.4)
  Top 0.254: X2.D+ 10.16,71.12 11.43,69.85 v11.43,67.31 | IC3.15 3.11,46.29 v3.17,46.35
  Bottom 0.254: v11.43,67.31 3.81,59.69 3.81,53.34 3.17,52.7 v3.17,46.35
N$53  (via drill 0.4)
  Top 0.254: X2.D- 10.14,67.33 v10.16,67.31 | IC3.16 1.42,44.6 v1.27,44.45
  Bottom 0.254: v10.16,67.31 10.16,66.67 3.17,59.69 3.17,53.98 1.27,52.07 v1.27,44.45
N$54
  Top 0.254: IC3.17 4.58,43.95 6.35,45.72 6.35,47.26 C24.2
N$55
  Top 0.254: U1.28 24.13,61.59 24.77,62.23 R45.1
N$56
  Top 0.254: U1.12 20.32,31.75 20.32,62.23 25.97,67.88 33.9,67.88 R28.2
N$57
  Top 0.254: R28.1 34.29,71.12 C31.1 36.83,73.66 D5.A
N$58
  Top 0.254: U1.11 14.61,28.57 14.61,22.23 15.88,20.95 19.68,20.95 26.04,14.61 R27.2
N$59  (via drill 0.4)
  Top 0.254: v79.38,2.54 78.74,1.91 68.58,1.91 66.04,4.45 66.04,8.89 64.77,10.16 64.77,15.88 62.87,17.78 41.91,17.78 41.27,17.14 41.27,12.06 40.64,11.43 26.35,11.43 R27.1
  Bottom 0.254: v79.38,2.54 79.38,20.95 C32.1 81.28,27.94 81.92,28.57 D4.A
N$63
  Top 0.254: R30.2 28.57,72.64 D6.A
N$64
  Top 0.254: R31.2 23.43,71.56 D7.A
OSC
  Top 0.254: U1.9 15.24,35.56 8.89,29.21 6.35,29.21 5.32,28.18 C20.2 5.32,24.4 Q1.2
OUTPUT
  Top 0.254: J3.T J3.TN 88.12,3.31 86.36,1.27 68.58,1.27 SV2.2
PWM_DC  (via drill 0.4)
  Top 0.254: v19.05,57.78 17.78,56.52 17.78,46.99 U1.5 | v69.85,56.52 R34.1
  Bottom 0.254: v69.85,56.52 69.22,57.15 29.84,57.15 28.57,55.88 27.3,55.88 25.4,57.78 v19.05,57.78
PWR_LED  (via drill 0.4)
  Top 0.254: v58.42,48.26 58.42,49.78 D1.K
  Bottom 0.254: v58.42,48.26 66.04,40.64 66.04,27.94 60.96,22.86 47.62,22.86 46.35,21.59 45.09,21.59 40.64,17.14 SV1.3
RESET#  (via drill 0.4)
  Top 0.254: IC3.19 4.55,42.65 v5.71,43.81 | R33.2 U1.1 15.24,54.61 10.79,54.61 10.16,53.98 10.16,51.62 R32.1 10.3,51.36 8.26,51.36 | 8.26,51.36 v8.26,48.9 | 8.26,51.36 SW2.P$2 | C37.2 9.53,33.66 v10.16,34.29
  Bottom 0.254: v5.71,43.81 5.71,46.35 v8.26,48.9 | v10.16,34.29 10.79,34.92 10.79,44.45 14.61,48.26 14.61,53.98 U1.1
RTS#
  Top 0.254: R32.2 10.54,48.01 8.26,45.72 8.26,38.73 8.89,38.1 IC3.3
RXD
  Top 0.254: IC3.5 12.09,39.4 13.97,41.27 13.97,45.97 12.06,47.88 12.06,53.15 R26.1
SPI_MISO
  Top 0.254: U1.18 27.94,30.48 28.57,29.84 28.57,27.3 34.29,21.59 40.01,21.59 40.64,20.95 62.87,20.95 63.5,21.59 67.31,21.59 73.03,15.88 IC6.2
SPI_MOSI  (via drill 0.4)
  Top 0.254: v64.77,19.05 40.64,19.05 40.01,18.41 40.01,13.34 39.37,12.7 31.75,12.7 29.59,14.86 U2.4 29.46,15.88 27.3,15.88 21.59,21.59 21.59,26.67 22.86,27.94 U1.17 | IC6.5 69.95,7.62 v69.22,7.62
  Bottom 0.254: v64.77,19.05 66.67,17.14 66.67,10.16 v69.22,7.62
SPI_SCK  (via drill 0.4)
  Top 0.254: IC6.6 71.75,9.02 70.48,10.16 69.85,10.79 66.67,10.79 66.04,11.43 66.04,19.68 65.41,20.32 64.77,20.32 64.14,19.68 40.01,19.68 39.37,19.05 39.37,13.97 38.73,13.34 33.02,13.34 32.13,14.22 U2.3 30.35,17.78 26.67,17.78 24.77,19.68 v24.77,20.32
  Bottom 0.254: v24.77,20.32 24.13,20.32 22.23,22.23 22.23,31.11 U1.19
TXD
  Top 0.254: IC3.1 11.4,36.8 14.61,40.01 14.61,48.45 R40.1
V_BIAS
  Top 0.254: 61.85,39.87 IC2.5 | 61.85,39.87 61.85,34.92 IC2.3 59.31,31.3 R6.1 54.53,29.14 C3.2 52.76,29.19 52.74,29.21 50.8,29.21 43.81,36.2 | 61.85,39.87 61.98,40.01 61.98,39.62 64.14,37.47 75.56,37.47 IC4.3 82.17,35.31 IC4.5 84.07,40.39 87,37.47 87,35.88 R5.2 | 43.81,36.2 41.27,34.29 IC1.3 41.01,32.12 C35.2 | 43.81,36.2 IC1.5
VCA_IN  (via drill 0.4)
  Top 0.254: IC2.1 54.23,37.85 52.7,39.37 50.74,39.43 R14.2 50.16,39.69 50.16,48.26 47.62,50.8 42.18,50.8 C14.2 41.91,57.15 38.73,60.33 38.73,63.19 R15.2 v38.42,68.9
  Bottom 0.254: v38.42,68.9 40.64,71.12 57.58,71.12 LDR2.2
VCA_OUT  (via drill 0.4)
  Top 0.254: R20.2 57.47,40.71 IC2.7 | v63.5,41.27 66.67,41.27 70.48,45.09 C17.2
  Bottom 0.254: v63.5,41.27 58.04,41.27 IC2.7
VCC
  Top 0.254: J1.1 95.99,76.66 J1.2 89.81,73.66 C25.2
  pour Top: 105.41,80.01 105.41,30.48 47.62,30.48 46.99,31.11 46.99,42.55 46.35,43.18 31.11,43.18 30.48,43.81 30.48,53.34 86.36,53.34 86.36,72.39 6.35,72.39 6.35,62.23 14.61,62.23 14.61,55.24 0,55.24 0,80.01
VCCIO  (via drill 0.4)
  Top 0.254: 25.09,69.66 R31.1 | 25.09,69.66 27.81,69.66 R30.1 | IC3.4 9.51,38.75 8.89,39.37 8.89,45.71 9.53,46.35 v10.15,46.35 v10.16,46.35 | v17.78,68.58 18.41,69.22 24.64,69.22 25.09,69.66
  Bottom 0.254: v10.16,46.35 11.43,46.35 13.95,48.87 13.95,64.75 v17.78,68.58
VCF_IN  (via drill 0.4)
  Top 0.254: 47.9,26.94 C10.2 48.26,26.67 v46.99,25.4 | R12.2 46.67,25.08 v46.99,25.4 | C6.1 45.72,26.67 v46.99,25.4
  Bottom 0.254: IC1.7 38.73,38.73 46.99,30.48 v46.99,25.4

### Text on the board
tPlace: Rev 1.0 | H.A.R.E | PSU Capstone Team 13